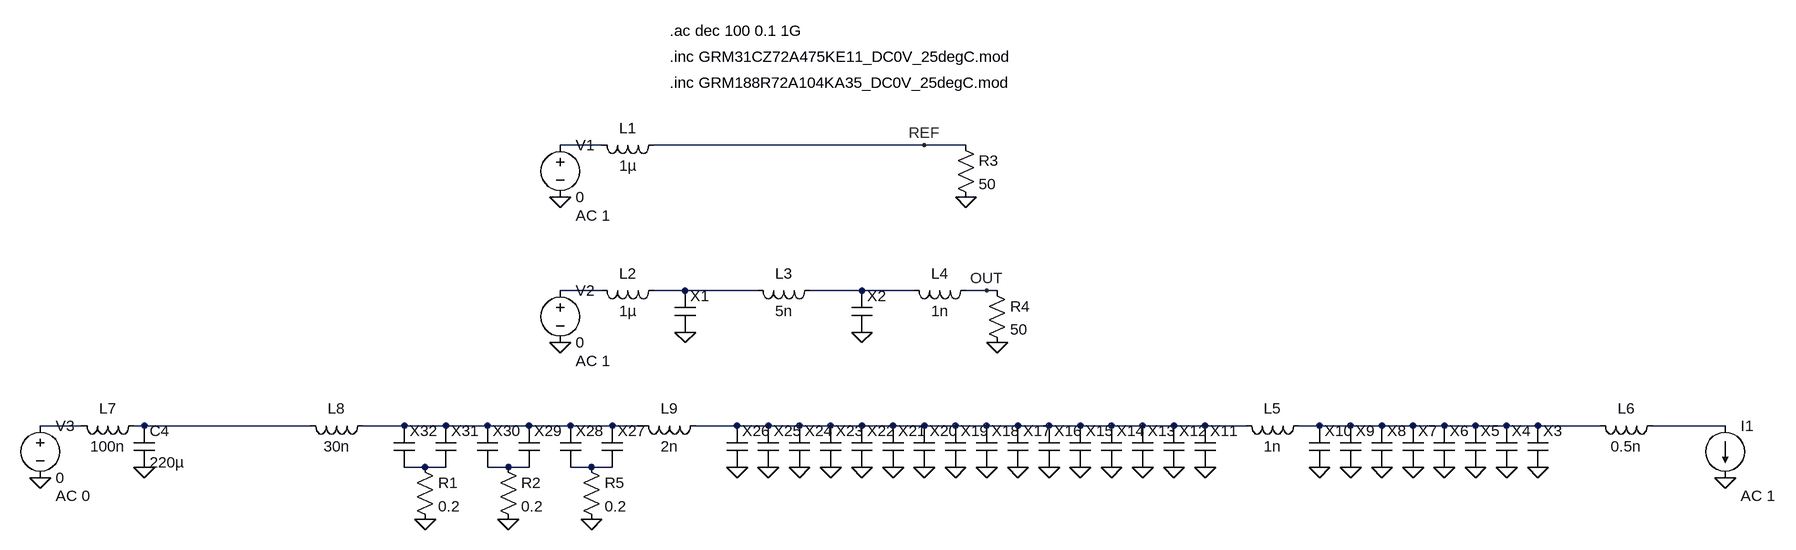
[diagram p0: schematic test.asc]
test.asc, the LTspice schematic file:
Version 4.1
SHEET 1 1472 820
WIRE -336 48 -400 48
WIRE 160 48 -256 48
WIRE 224 48 160 48
WIRE -336 272 -400 272
WIRE -208 272 -256 272
WIRE -96 272 -208 272
WIRE 64 272 -16 272
WIRE 144 272 64 272
WIRE 256 272 224 272
WIRE 272 272 256 272
WIRE -1136 480 -1200 480
WIRE -1040 480 -1056 480
WIRE -784 480 -1040 480
WIRE -640 480 -704 480
WIRE -576 480 -640 480
WIRE -512 480 -576 480
WIRE -448 480 -512 480
WIRE -384 480 -448 480
WIRE -320 480 -384 480
WIRE -272 480 -320 480
WIRE -128 480 -192 480
WIRE -80 480 -128 480
WIRE -32 480 -80 480
WIRE 16 480 -32 480
WIRE 64 480 16 480
WIRE 112 480 64 480
WIRE 160 480 112 480
WIRE 208 480 160 480
WIRE 256 480 208 480
WIRE 304 480 256 480
WIRE 352 480 304 480
WIRE 400 480 352 480
WIRE 448 480 400 480
WIRE 496 480 448 480
WIRE 544 480 496 480
WIRE 592 480 544 480
WIRE 656 480 592 480
WIRE 768 480 736 480
WIRE 816 480 768 480
WIRE 864 480 816 480
WIRE 912 480 864 480
WIRE 960 480 912 480
WIRE 1008 480 960 480
WIRE 1056 480 1008 480
WIRE 1104 480 1056 480
WIRE 1200 480 1104 480
WIRE 1392 480 1280 480
WIRE -608 544 -640 544
WIRE -576 544 -608 544
WIRE -480 544 -512 544
WIRE -448 544 -480 544
WIRE -352 544 -384 544
WIRE -320 544 -352 544
FLAG -400 128 0
FLAG 224 128 0
FLAG -400 352 0
FLAG 272 352 0
FLAG 64 336 0
FLAG -208 336 0
FLAG 160 48 REF
FLAG 256 272 OUT
FLAG 1392 560 0
FLAG -1200 560 0
FLAG -1040 544 0
FLAG 1104 544 0
FLAG 1056 544 0
FLAG 1008 544 0
FLAG 960 544 0
FLAG 912 544 0
FLAG 864 544 0
FLAG 816 544 0
FLAG 768 544 0
FLAG 592 544 0
FLAG 544 544 0
FLAG 496 544 0
FLAG 448 544 0
FLAG 400 544 0
FLAG 352 544 0
FLAG 304 544 0
FLAG 256 544 0
FLAG 208 544 0
FLAG 160 544 0
FLAG 112 544 0
FLAG 64 544 0
FLAG 16 544 0
FLAG -32 544 0
FLAG -80 544 0
FLAG -128 544 0
FLAG -608 624 0
FLAG -480 624 0
FLAG -352 624 0
SYMBOL cap -224 272 R0
WINDOW 3 24 56 Invisible 2
SYMATTR Value GRM188R72A104KA35_DC0V_25degC
SYMATTR InstName X1
SYMATTR Prefix X
SYMBOL cap 48 272 R0
WINDOW 3 24 56 Invisible 2
SYMATTR Value GRM31CZ72A475KE11_DC0V_25degC
SYMATTR InstName X2
SYMATTR Prefix X
SYMBOL voltage -400 32 R0
WINDOW 123 24 124 Left 2
WINDOW 39 0 0 Left 0
SYMATTR Value2 AC 1
SYMATTR InstName V1
SYMATTR Value 0
SYMBOL voltage -400 256 R0
WINDOW 123 24 124 Left 2
WINDOW 39 0 0 Left 0
SYMATTR Value2 AC 1
SYMATTR InstName V2
SYMATTR Value 0
SYMBOL res 208 32 R0
SYMATTR InstName R3
SYMATTR Value 50
SYMBOL res 256 256 R0
SYMATTR InstName R4
SYMATTR Value 50
SYMBOL ind -240 32 R90
WINDOW 0 5 56 VBottom 2
WINDOW 3 32 56 VTop 2
SYMATTR InstName L1
SYMATTR Value 1µ
SYMATTR SpiceLine Rser=0.05
SYMBOL ind -240 256 R90
WINDOW 0 5 56 VBottom 2
WINDOW 3 32 56 VTop 2
SYMATTR InstName L2
SYMATTR Value 1µ
SYMATTR SpiceLine Rser=0.05
SYMBOL ind 0 256 R90
WINDOW 0 5 56 VBottom 2
WINDOW 3 32 56 VTop 2
SYMATTR InstName L3
SYMATTR Value 5n
SYMATTR SpiceLine Rser=5m
SYMBOL ind 240 256 R90
WINDOW 0 5 56 VBottom 2
WINDOW 3 32 56 VTop 2
SYMATTR InstName L4
SYMATTR Value 1n
SYMATTR SpiceLine Rser=1m
SYMBOL current 1392 480 R0
WINDOW 123 24 108 Left 2
WINDOW 39 0 0 Left 0
SYMATTR Value2 AC 1
SYMATTR InstName I1
SYMATTR Value ""
SYMBOL ind 1296 464 R90
WINDOW 0 5 56 VBottom 2
WINDOW 3 32 56 VTop 2
SYMATTR InstName L6
SYMATTR Value 0.5n
SYMATTR SpiceLine Rser=1m
SYMBOL voltage -1200 464 R0
WINDOW 123 24 124 Left 2
WINDOW 39 0 0 Left 0
SYMATTR Value2 AC 0
SYMATTR InstName V3
SYMATTR Value 0
SYMBOL ind -1040 464 R90
WINDOW 0 5 56 VBottom 2
WINDOW 3 32 56 VTop 2
SYMATTR InstName L7
SYMATTR Value 100n
SYMATTR SpiceLine Rser=0.1m
SYMBOL ind -688 464 R90
WINDOW 0 5 56 VBottom 2
WINDOW 3 32 56 VTop 2
SYMATTR InstName L8
SYMATTR Value 30n
SYMATTR SpiceLine Rser=10m
SYMBOL cap -1056 480 R0
SYMATTR Value 220µ
SYMATTR InstName C4
SYMATTR SpiceLine V=80 Irms=600m Rser=0.2252 Lser=28.406n mfg="W�rth Elektronik" pn="865081763011 WCAP-ASLI 16x17" type="Al electrolytic"
SYMBOL cap 1088 480 R0
WINDOW 3 24 56 Invisible 2
SYMATTR Value GRM188R72A104KA35_DC0V_25degC
SYMATTR InstName X3
SYMATTR Prefix X
SYMBOL cap 1040 480 R0
WINDOW 3 24 56 Invisible 2
SYMATTR Value GRM188R72A104KA35_DC0V_25degC
SYMATTR InstName X4
SYMATTR Prefix X
SYMBOL cap 992 480 R0
WINDOW 3 24 56 Invisible 2
SYMATTR Value GRM188R72A104KA35_DC0V_25degC
SYMATTR InstName X5
SYMATTR Prefix X
SYMBOL cap 944 480 R0
WINDOW 3 24 56 Invisible 2
SYMATTR Value GRM188R72A104KA35_DC0V_25degC
SYMATTR InstName X6
SYMATTR Prefix X
SYMBOL cap 896 480 R0
WINDOW 3 24 56 Invisible 2
SYMATTR Value GRM188R72A104KA35_DC0V_25degC
SYMATTR InstName X7
SYMATTR Prefix X
SYMBOL cap 848 480 R0
WINDOW 3 24 56 Invisible 2
SYMATTR Value GRM188R72A104KA35_DC0V_25degC
SYMATTR InstName X8
SYMATTR Prefix X
SYMBOL cap 800 480 R0
WINDOW 3 24 56 Invisible 2
SYMATTR Value GRM188R72A104KA35_DC0V_25degC
SYMATTR InstName X9
SYMATTR Prefix X
SYMBOL cap 752 480 R0
WINDOW 3 24 56 Invisible 2
SYMATTR Value GRM188R72A104KA35_DC0V_25degC
SYMATTR InstName X10
SYMATTR Prefix X
SYMBOL cap 576 480 R0
WINDOW 3 24 56 Invisible 2
SYMATTR Value GRM188R72A104KA35_DC0V_25degC
SYMATTR InstName X11
SYMATTR Prefix X
SYMBOL cap 528 480 R0
WINDOW 3 24 56 Invisible 2
SYMATTR Value GRM188R72A104KA35_DC0V_25degC
SYMATTR InstName X12
SYMATTR Prefix X
SYMBOL cap 480 480 R0
WINDOW 3 24 56 Invisible 2
SYMATTR Value GRM188R72A104KA35_DC0V_25degC
SYMATTR InstName X13
SYMATTR Prefix X
SYMBOL cap 432 480 R0
WINDOW 3 24 56 Invisible 2
SYMATTR Value GRM188R72A104KA35_DC0V_25degC
SYMATTR InstName X14
SYMATTR Prefix X
SYMBOL cap 384 480 R0
WINDOW 3 24 56 Invisible 2
SYMATTR Value GRM188R72A104KA35_DC0V_25degC
SYMATTR InstName X15
SYMATTR Prefix X
SYMBOL cap 336 480 R0
WINDOW 3 24 56 Invisible 2
SYMATTR Value GRM188R72A104KA35_DC0V_25degC
SYMATTR InstName X16
SYMATTR Prefix X
SYMBOL cap 288 480 R0
WINDOW 3 24 56 Invisible 2
SYMATTR Value GRM188R72A104KA35_DC0V_25degC
SYMATTR InstName X17
SYMATTR Prefix X
SYMBOL cap 240 480 R0
WINDOW 3 24 56 Invisible 2
SYMATTR Value GRM188R72A104KA35_DC0V_25degC
SYMATTR InstName X18
SYMATTR Prefix X
SYMBOL cap 192 480 R0
WINDOW 3 24 56 Invisible 2
SYMATTR Value GRM188R72A104KA35_DC0V_25degC
SYMATTR InstName X19
SYMATTR Prefix X
SYMBOL cap 144 480 R0
WINDOW 3 24 56 Invisible 2
SYMATTR Value GRM188R72A104KA35_DC0V_25degC
SYMATTR InstName X20
SYMATTR Prefix X
SYMBOL cap 96 480 R0
WINDOW 3 24 56 Invisible 2
SYMATTR Value GRM188R72A104KA35_DC0V_25degC
SYMATTR InstName X21
SYMATTR Prefix X
SYMBOL cap 48 480 R0
WINDOW 3 24 56 Invisible 2
SYMATTR Value GRM188R72A104KA35_DC0V_25degC
SYMATTR InstName X22
SYMATTR Prefix X
SYMBOL cap 0 480 R0
WINDOW 3 24 56 Invisible 2
SYMATTR Value GRM188R72A104KA35_DC0V_25degC
SYMATTR InstName X23
SYMATTR Prefix X
SYMBOL cap -48 480 R0
WINDOW 3 24 56 Invisible 2
SYMATTR Value GRM188R72A104KA35_DC0V_25degC
SYMATTR InstName X24
SYMATTR Prefix X
SYMBOL cap -96 480 R0
WINDOW 3 24 56 Invisible 2
SYMATTR Value GRM188R72A104KA35_DC0V_25degC
SYMATTR InstName X25
SYMATTR Prefix X
SYMBOL cap -144 480 R0
WINDOW 3 24 56 Invisible 2
SYMATTR Value GRM188R72A104KA35_DC0V_25degC
SYMATTR InstName X26
SYMATTR Prefix X
SYMBOL cap -336 480 R0
WINDOW 3 24 56 Invisible 2
SYMATTR Value GRM31CZ72A475KE11_DC0V_25degC
SYMATTR InstName X27
SYMATTR Prefix X
SYMBOL cap -400 480 R0
WINDOW 3 24 56 Invisible 2
SYMATTR Value GRM31CZ72A475KE11_DC0V_25degC
SYMATTR InstName X28
SYMATTR Prefix X
SYMBOL cap -464 480 R0
WINDOW 3 24 56 Invisible 2
SYMATTR Value GRM31CZ72A475KE11_DC0V_25degC
SYMATTR InstName X29
SYMATTR Prefix X
SYMBOL cap -528 480 R0
WINDOW 3 24 56 Invisible 2
SYMATTR Value GRM31CZ72A475KE11_DC0V_25degC
SYMATTR InstName X30
SYMATTR Prefix X
SYMBOL cap -592 480 R0
WINDOW 3 24 56 Invisible 2
SYMATTR Value GRM31CZ72A475KE11_DC0V_25degC
SYMATTR InstName X31
SYMATTR Prefix X
SYMBOL cap -656 480 R0
WINDOW 3 24 56 Invisible 2
SYMATTR Value GRM31CZ72A475KE11_DC0V_25degC
SYMATTR InstName X32
SYMATTR Prefix X
SYMBOL res -624 528 R0
SYMATTR InstName R1
SYMATTR Value 0.2
SYMBOL res -496 528 R0
SYMATTR InstName R2
SYMATTR Value 0.2
SYMBOL res -368 528 R0
SYMATTR InstName R5
SYMATTR Value 0.2
SYMBOL ind -176 464 R90
WINDOW 0 5 56 VBottom 2
WINDOW 3 32 56 VTop 2
SYMATTR InstName L9
SYMATTR Value 2n
SYMATTR SpiceLine Rser=2m
SYMBOL ind 752 464 R90
WINDOW 0 5 56 VBottom 2
WINDOW 3 32 56 VTop 2
SYMATTR InstName L5
SYMATTR Value 1n
SYMATTR SpiceLine Rser=1m
TEXT -232 -88 Left 2 !.inc GRM31CZ72A475KE11_DC0V_25degC.mod
TEXT -232 -48 Left 2 !.inc GRM188R72A104KA35_DC0V_25degC.mod
TEXT -232 -128 Left 2 !.ac dec 100 0.1 1G

The netlist it stands for:
* test.asc
X§X1 N003 0 GRM188R72A104KA35_DC0V_25degC  ; pins A B
X§X2 N004 0 GRM31CZ72A475KE11_DC0V_25degC  ; pins A B
V1 N001 0 0 AC 1
V2 N002 0 0 AC 1
R3 REF 0 50
R4 OUT 0 50
L1 REF N001 1µ Rser=0.05
L2 N003 N002 1µ Rser=0.05
L3 N004 N003 5n Rser=5m
L4 OUT N004 1n Rser=1m
I1 N010 0 AC 1
L6 N010 N009 0.5n Rser=1m
V3 N005 0 0 AC 0
L7 N006 N005 100n Rser=0.1m
L8 N007 N006 30n Rser=10m
C4 N006 0 220µ V=80 Irms=600m Rser=0.2252 Lser=28.406n mfg="W�rth Elektronik" pn="865081763011 WCAP-ASLI 16x17" type="Al electrolytic"
X§X3 N009 0 GRM188R72A104KA35_DC0V_25degC  ; pins A B
X§X4 N009 0 GRM188R72A104KA35_DC0V_25degC  ; pins A B
X§X5 N009 0 GRM188R72A104KA35_DC0V_25degC  ; pins A B
X§X6 N009 0 GRM188R72A104KA35_DC0V_25degC  ; pins A B
X§X7 N009 0 GRM188R72A104KA35_DC0V_25degC  ; pins A B
X§X8 N009 0 GRM188R72A104KA35_DC0V_25degC  ; pins A B
X§X9 N009 0 GRM188R72A104KA35_DC0V_25degC  ; pins A B
X§X10 N009 0 GRM188R72A104KA35_DC0V_25degC  ; pins A B
X§X11 N008 0 GRM188R72A104KA35_DC0V_25degC  ; pins A B
X§X12 N008 0 GRM188R72A104KA35_DC0V_25degC  ; pins A B
X§X13 N008 0 GRM188R72A104KA35_DC0V_25degC  ; pins A B
X§X14 N008 0 GRM188R72A104KA35_DC0V_25degC  ; pins A B
X§X15 N008 0 GRM188R72A104KA35_DC0V_25degC  ; pins A B
X§X16 N008 0 GRM188R72A104KA35_DC0V_25degC  ; pins A B
X§X17 N008 0 GRM188R72A104KA35_DC0V_25degC  ; pins A B
X§X18 N008 0 GRM188R72A104KA35_DC0V_25degC  ; pins A B
X§X19 N008 0 GRM188R72A104KA35_DC0V_25degC  ; pins A B
X§X20 N008 0 GRM188R72A104KA35_DC0V_25degC  ; pins A B
X§X21 N008 0 GRM188R72A104KA35_DC0V_25degC  ; pins A B
X§X22 N008 0 GRM188R72A104KA35_DC0V_25degC  ; pins A B
X§X23 N008 0 GRM188R72A104KA35_DC0V_25degC  ; pins A B
X§X24 N008 0 GRM188R72A104KA35_DC0V_25degC  ; pins A B
X§X25 N008 0 GRM188R72A104KA35_DC0V_25degC  ; pins A B
X§X26 N008 0 GRM188R72A104KA35_DC0V_25degC  ; pins A B
X§X27 N007 N013 GRM31CZ72A475KE11_DC0V_25degC  ; pins A B
X§X28 N007 N013 GRM31CZ72A475KE11_DC0V_25degC  ; pins A B
X§X29 N007 N012 GRM31CZ72A475KE11_DC0V_25degC  ; pins A B
X§X30 N007 N012 GRM31CZ72A475KE11_DC0V_25degC  ; pins A B
X§X31 N007 N011 GRM31CZ72A475KE11_DC0V_25degC  ; pins A B
X§X32 N007 N011 GRM31CZ72A475KE11_DC0V_25degC  ; pins A B
R1 N011 0 0.2
R2 N012 0 0.2
R5 N013 0 0.2
L9 N008 N007 2n Rser=2m
L5 N009 N008 1n Rser=1m
.inc GRM31CZ72A475KE11_DC0V_25degC.mod
.inc GRM188R72A104KA35_DC0V_25degC.mod
.ac dec 100 0.1 1G
.backanno
.end